# EAGLE design SVS (EAGLE 8.7.1)
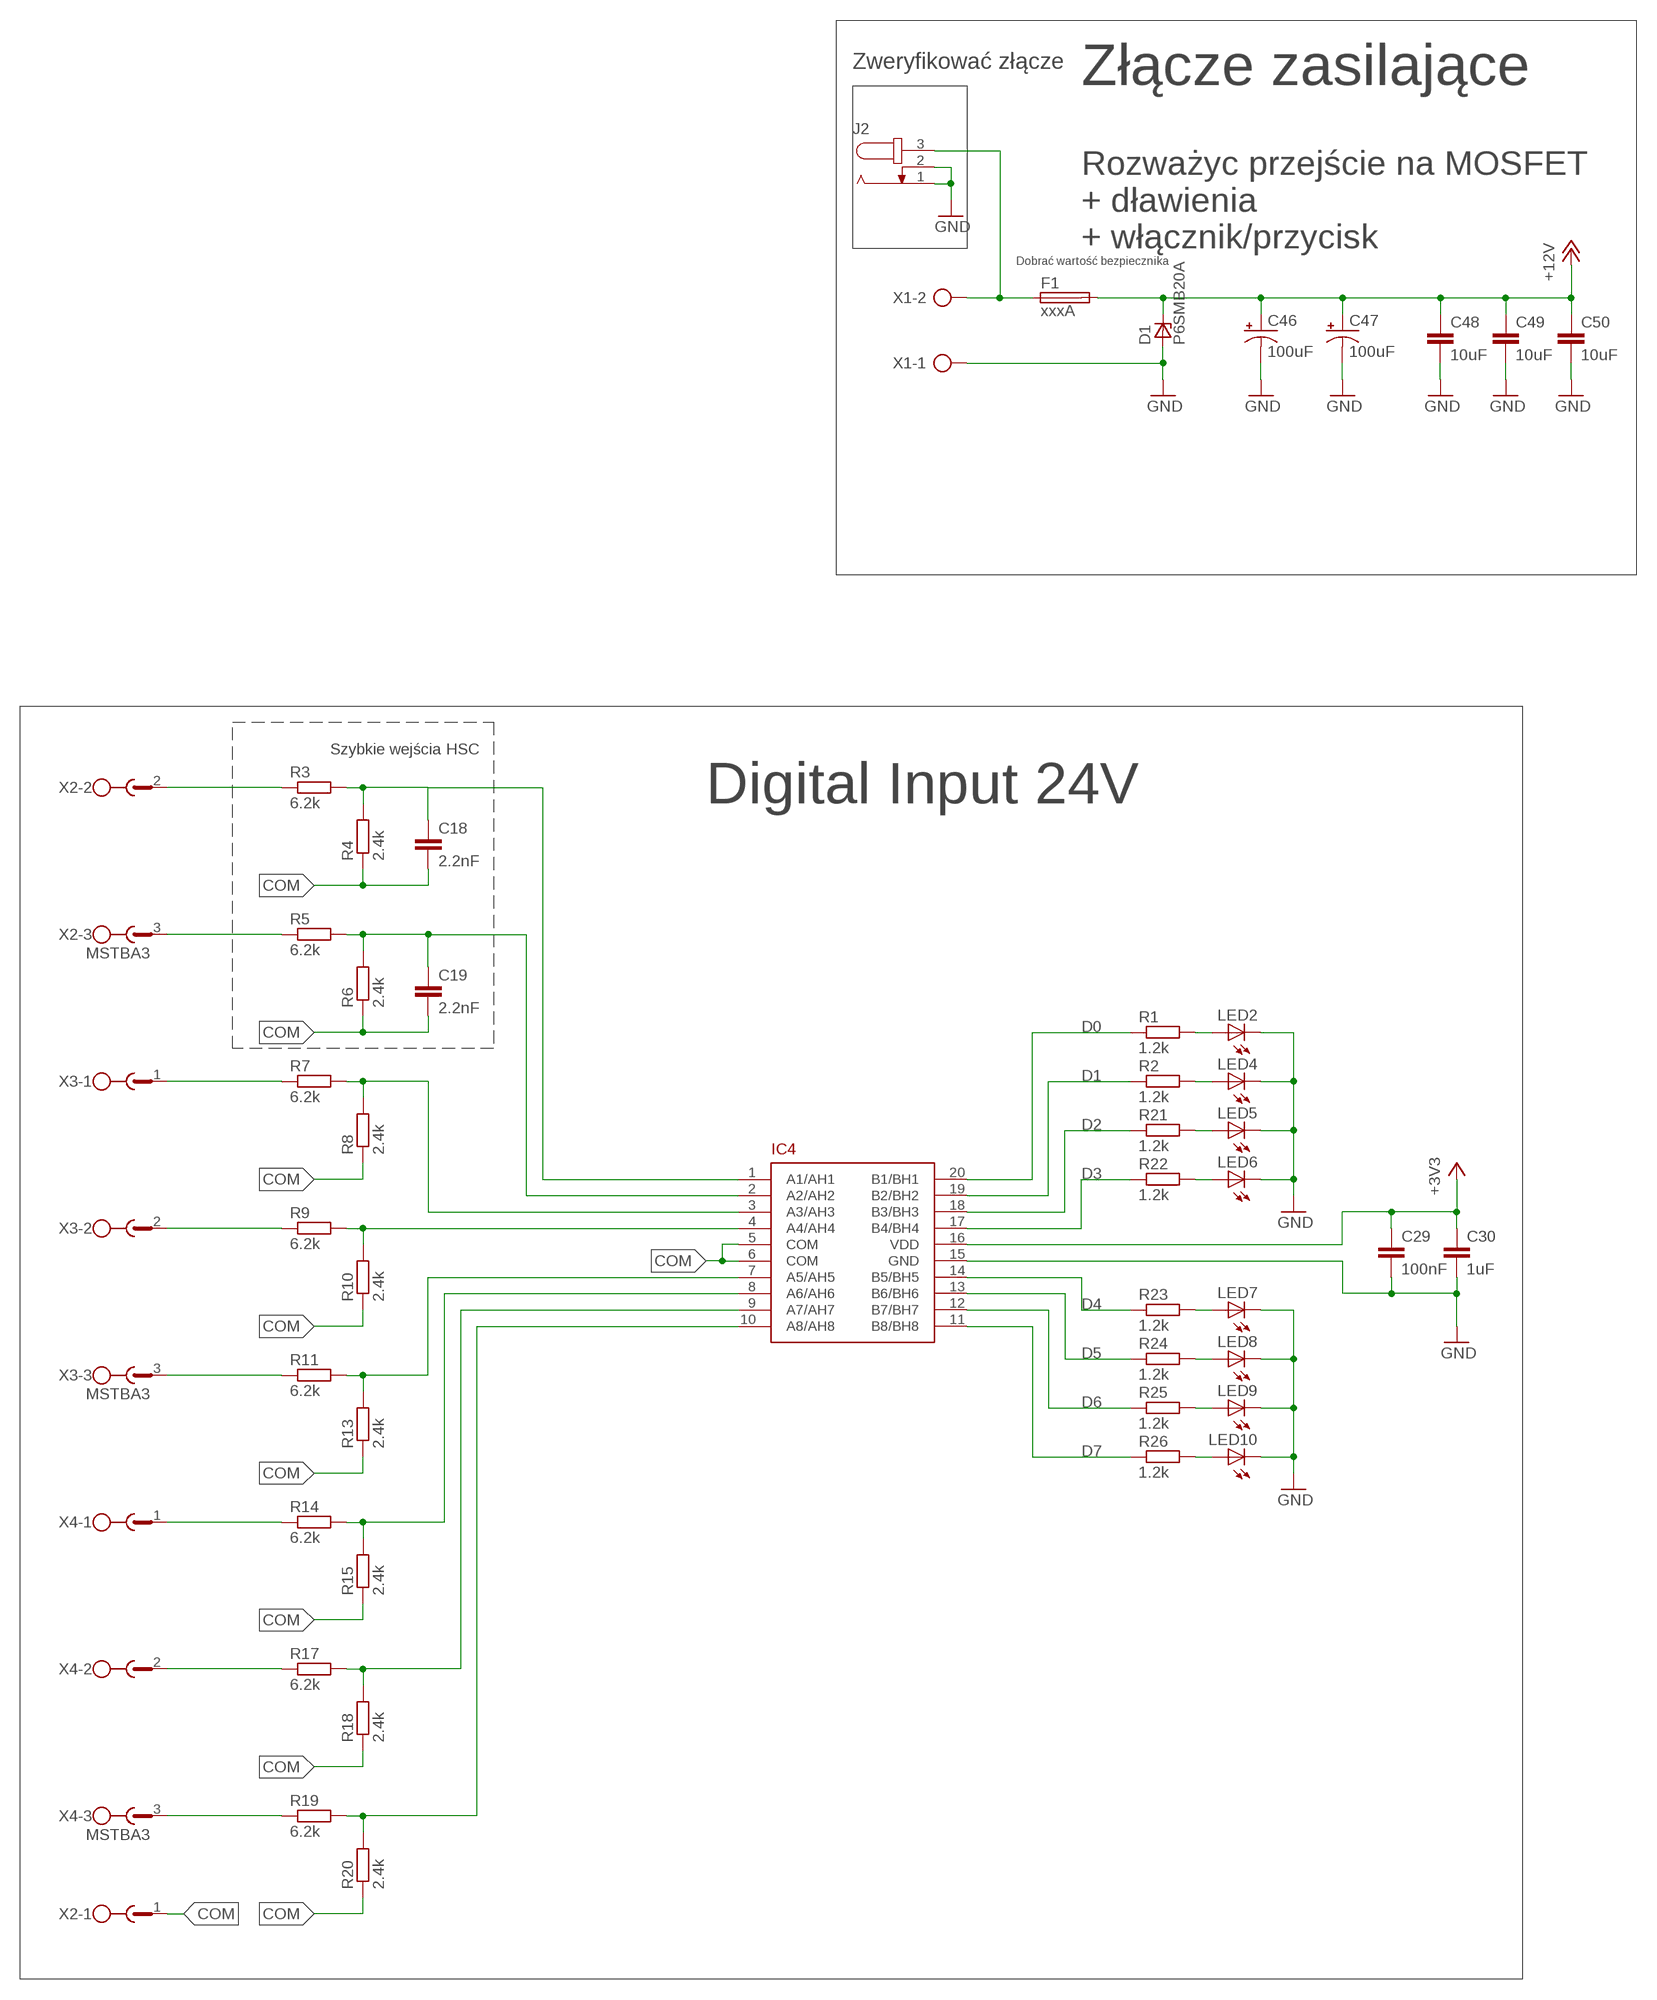
[diagram p0: schematic, sheet 1, part 1 of 3]
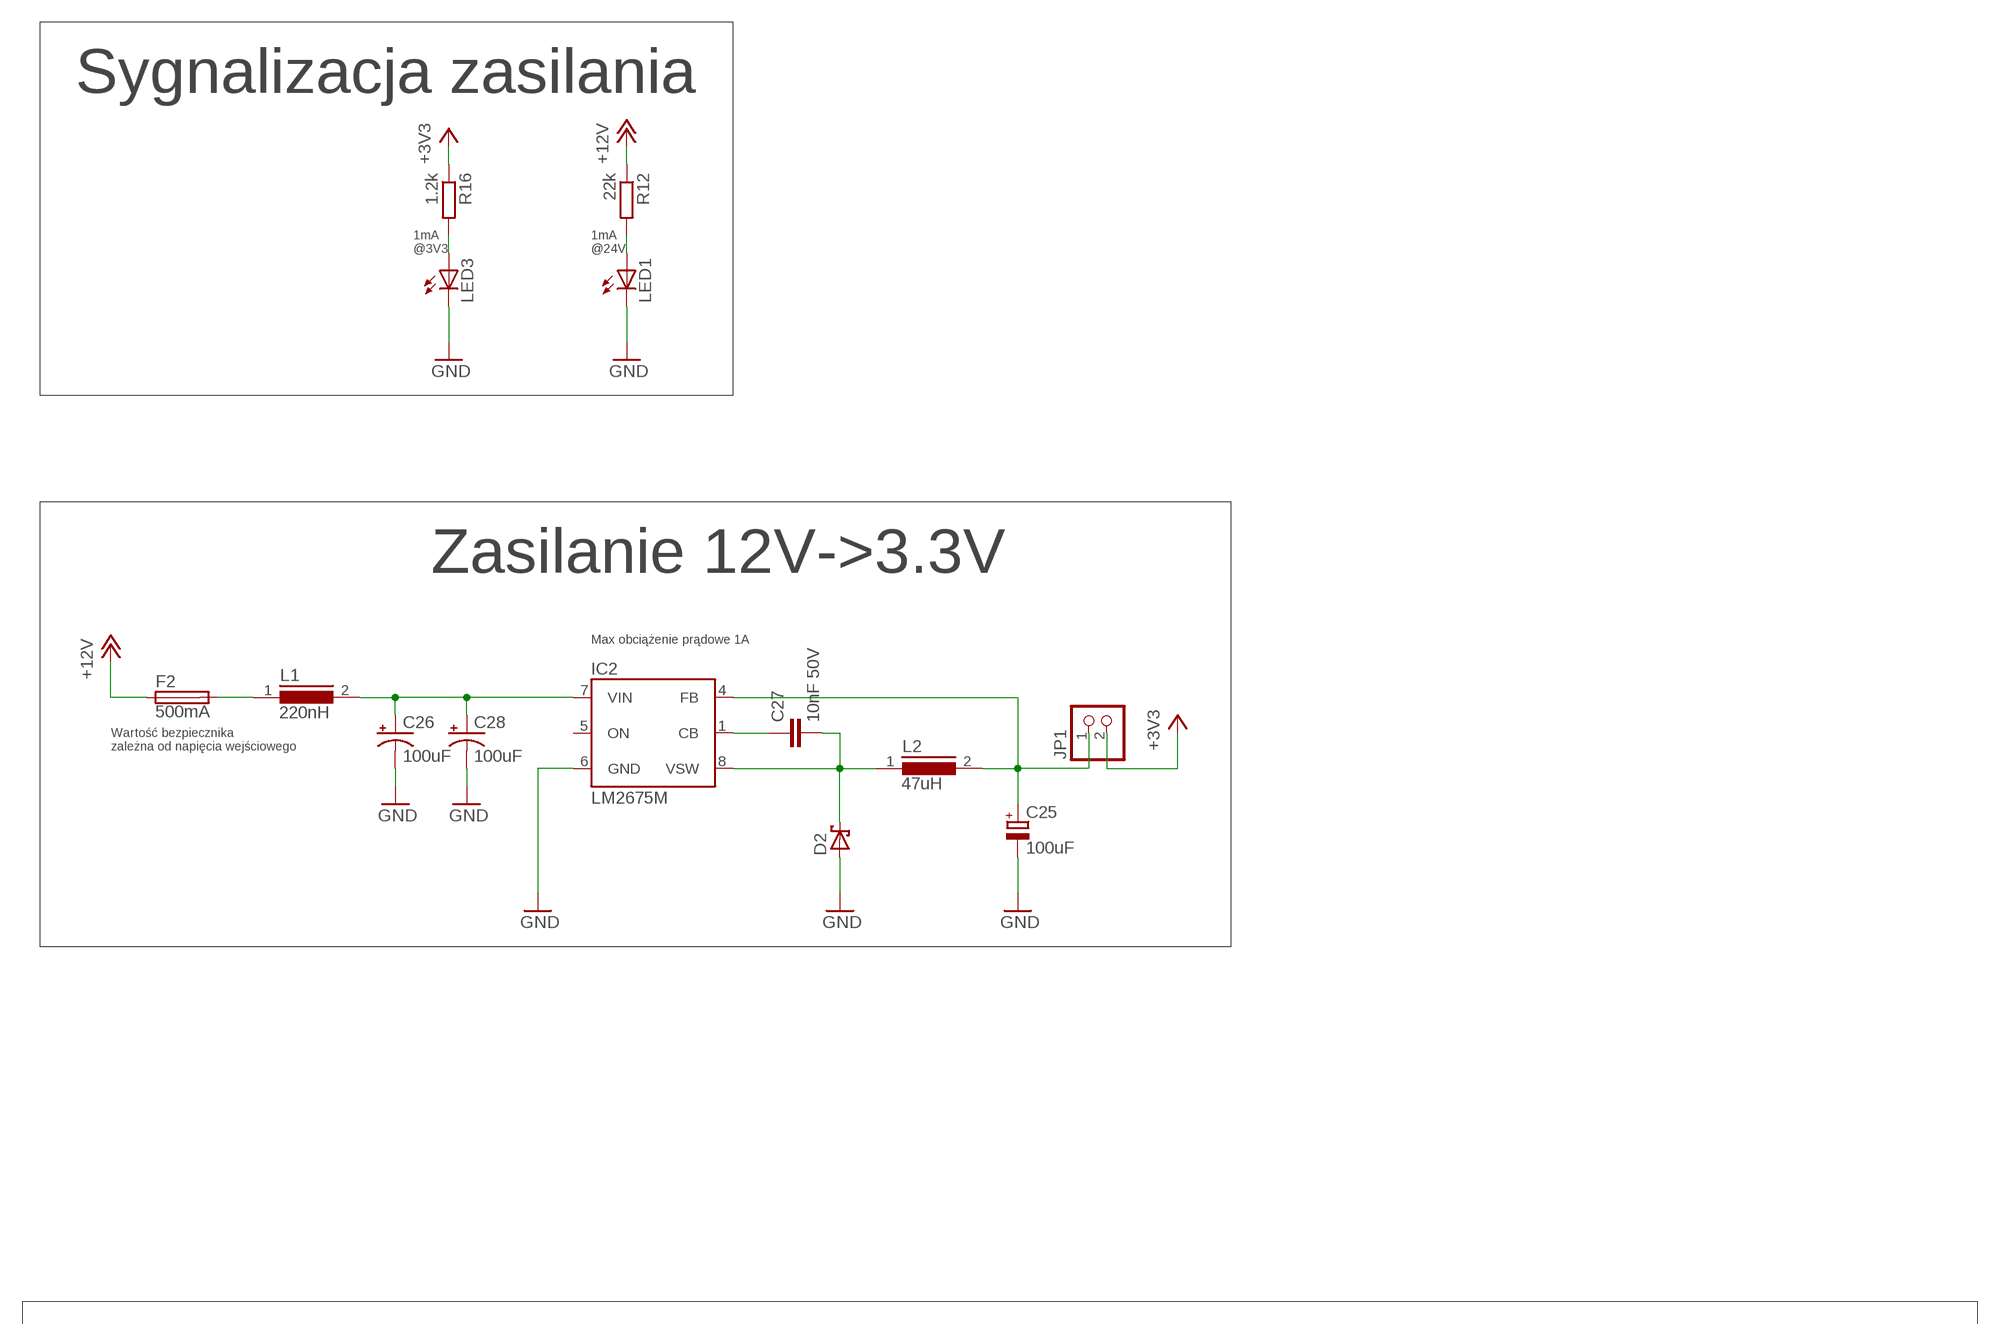
[diagram p1: schematic, sheet 1, part 2 of 3]
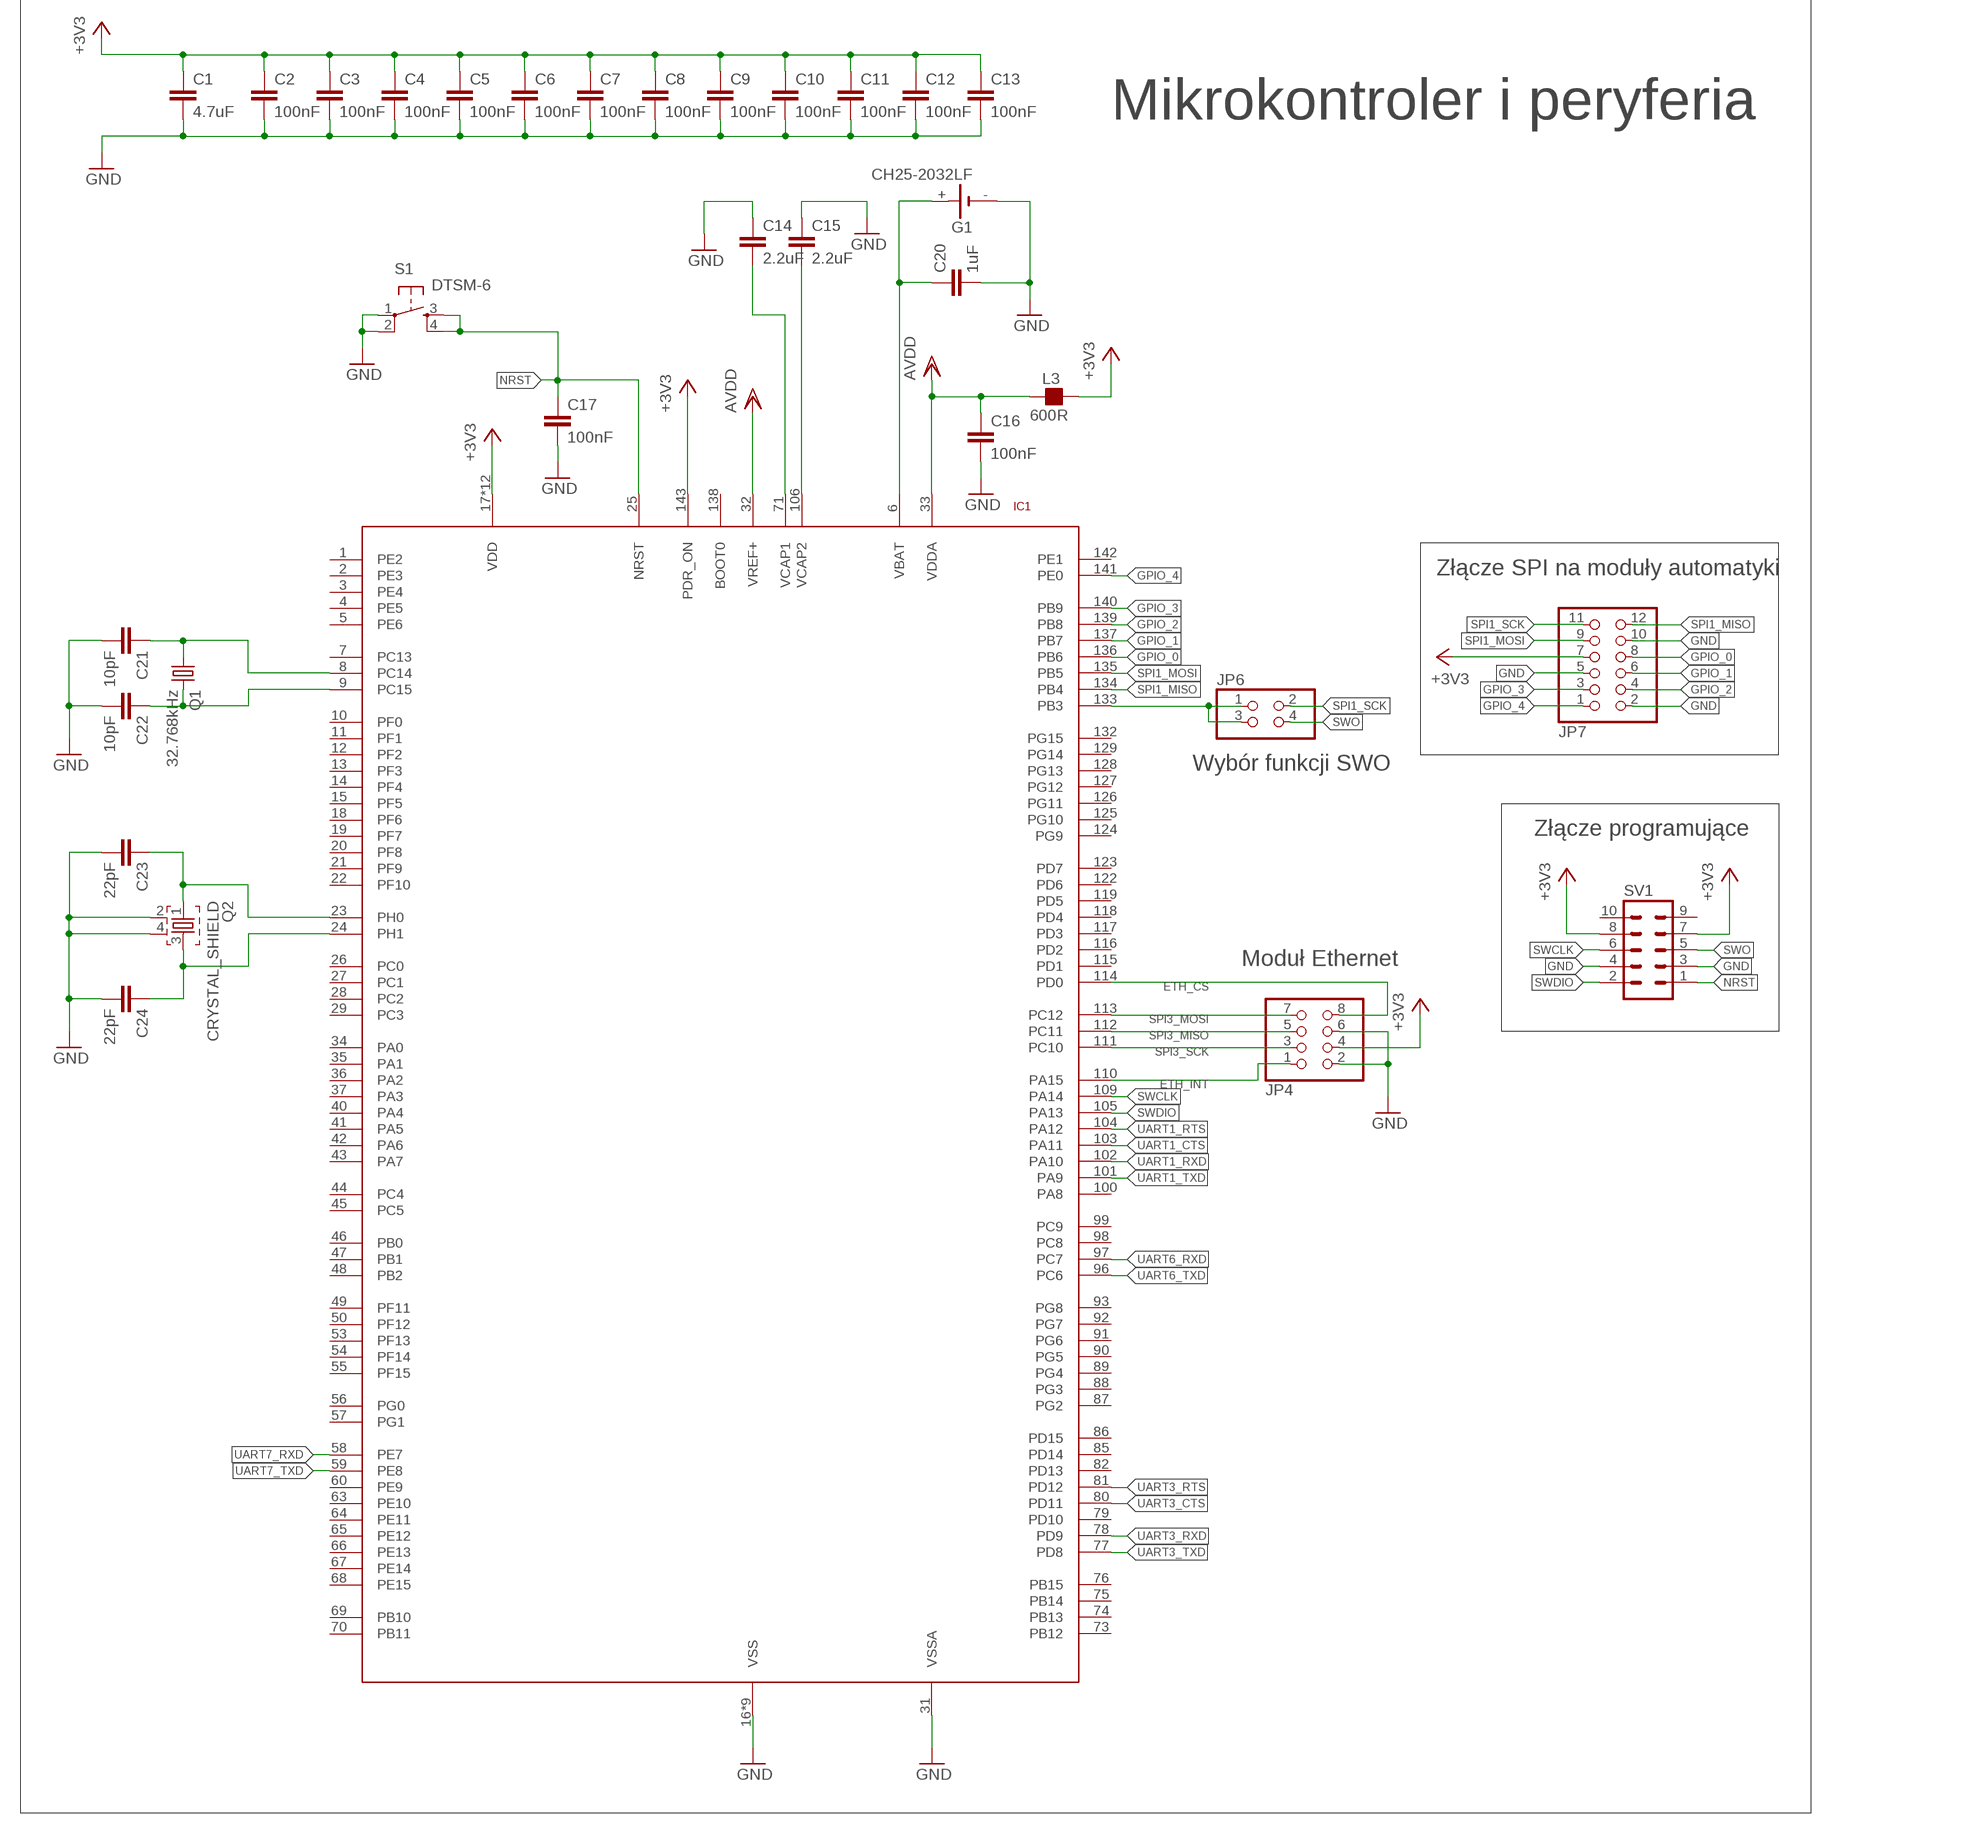
[diagram p2: schematic, sheet 1, part 3 of 3]

## Parts
C1  4.7uF  C-EUC0603K  [C0603K]
C2  100nF  C-EUC0603K  [C0603K]
C3  100nF  C-EUC0603K  [C0603K]
C4  100nF  C-EUC0603K  [C0603K]
C5  100nF  C-EUC0603K  [C0603K]
C6  100nF  C-EUC0603K  [C0603K]
C7  100nF  C-EUC0603K  [C0603K]
C8  100nF  C-EUC0603K  [C0603K]
C9  100nF  C-EUC0603K  [C0603K]
C10  100nF  C-EUC0603K  [C0603K]
C11  100nF  C-EUC0603K  [C0603K]
C12  100nF  C-EUC0603K  [C0603K]
C13  100nF  C-EUC0603K  [C0603K]
C14  2.2uF  C-EUC0603K  [C0603K]
C15  2.2uF  C-EUC0603K  [C0603K]
C16  100nF  C-EUC0603K  [C0603K]
C17  100nF  C-EUC0603K  [C0603K]
C18  2.2nF  C-EUC0805  [C0805]
C19  2.2nF  C-EUC0805  [C0805]
C20  1uF  C-EUC0603K  [C0603K]
C21  10pF  C-EUC0603K  [C0603K]
C22  10pF  C-EUC0603K  [C0603K]
C23  22pF  C-EUC0603K  [C0603K]
C24  22pF  C-EUC0603K  [C0603K]
C25  100uF  CPOL-EUSMCC  [SMC_C]
C26  100uF  CPOL-USUD-8X10  [UD-8X10_NICHICON]
C27  10nF 50V  C-EUC0603  [C0603]
C28  100uF  CPOL-USUD-8X10  [UD-8X10_NICHICON]
C29  100nF  C-EUC0603K  [C0603K]
C30  1uF  C-EUC0603K  [C0603K]
C46  100uF  CPOL-USUD-8X10  [UD-8X10_NICHICON]
C47  100uF  CPOL-USUD-8X10  [UD-8X10_NICHICON]
C48  10uF  C-EUC0805  [C0805]
C49  10uF  C-EUC0805  [C0805]
C50  10uF  C-EUC0805  [C0805]
D1  P6SMB20A  [SMB_A]
D2  SCHOTTKY-DIODESMD  [SMB]
F1  xxxA  TR5  [TR5]
F2  500mA  TR5  [TR5]
G1  CH25-2032LF  [CH25-2032LF]
IC1  STM32F429ZILQFP144  [LQFP144]
IC2  LM2675M  [SO08]
IC4  SI838X  [QSOP-20]
J2  JACK-PLUG1  [SPC4078]
JP1  PINHD-1X2  [1X02]
JP4  PINHD-2X4  [2X04]
JP6  PINHD-2X2  [2X02]
JP7  PINHD-2X6/90  [2X06/90]
L1  220nH  SRP7028A-R33M  [7.3X6.3]
L2  47uH  SRR1280-101M  [12.5X12.5]
L3  600R  FB_0603  [L0603]
LED1  LEDCHIP-LED0603  [CHIP-LED0603]
LED2  LEDCHIP-LED0603  [CHIP-LED0603]
LED3  LEDCHIP-LED0603  [CHIP-LED0603]
LED4  LEDCHIP-LED0603  [CHIP-LED0603]
LED5  LEDCHIP-LED0603  [CHIP-LED0603]
LED6  LEDCHIP-LED0603  [CHIP-LED0603]
LED7  LEDCHIP-LED0603  [CHIP-LED0603]
LED8  LEDCHIP-LED0603  [CHIP-LED0603]
LED9  LEDCHIP-LED0603  [CHIP-LED0603]
LED10  LEDCHIP-LED0603  [CHIP-LED0603]
Q1  32.768kHz  CRYSTAL3.5X1.5  [CRYSTAL_3.5X1.5]
Q2  CRYSTAL_SHIELD  [CRYSTAL_5X3.2]
R1  1.2k  R-EU_R0603  [R0603]
R2  1.2k  R-EU_R0603  [R0603]
R3  6.2k  R-EU_R1206  [R1206]
R4  2.4k  R-EU_R1206  [R1206]
R5  6.2k  R-EU_R1206  [R1206]
R6  2.4k  R-EU_R1206  [R1206]
R7  6.2k  R-EU_R1206  [R1206]
R8  2.4k  R-EU_R1206  [R1206]
R9  6.2k  R-EU_R1206  [R1206]
R10  2.4k  R-EU_R1206  [R1206]
R11  6.2k  R-EU_R1206  [R1206]
R12  22k  R-EU_R0603  [R0603]
R13  2.4k  R-EU_R1206  [R1206]
R14  6.2k  R-EU_R1206  [R1206]
R15  2.4k  R-EU_R1206  [R1206]
R16  1.2k  R-EU_R0603  [R0603]
R17  6.2k  R-EU_R1206  [R1206]
R18  2.4k  R-EU_R1206  [R1206]
R19  6.2k  R-EU_R1206  [R1206]
R20  2.4k  R-EU_R1206  [R1206]
R21  1.2k  R-EU_R0603  [R0603]
R22  1.2k  R-EU_R0603  [R0603]
R23  1.2k  R-EU_R0603  [R0603]
R24  1.2k  R-EU_R0603  [R0603]
R25  1.2k  R-EU_R0603  [R0603]
R26  1.2k  R-EU_R0603  [R0603]
S1  DTSM-6  [DTSM-6]
SV1  ML10  [ML10]
X1  AK300/2  [AK300/2]
X2  MSTBA3  [MSTBA3]
X3  MSTBA3  [MSTBA3]
X4  MSTBA3  [MSTBA3]

## Nets
+3V3: C1.1 C2.1 C3.1 C4.1 C5.1 C6.1 C7.1 C8.1 C9.1 C10.1 C11.1 C12.1 C13.1 C29.1 C30.1 IC1.17(VDD) IC1.30(VDD) IC1.39(VDD) IC1.52(VDD) IC1.62(VDD) IC1.72(VDD) IC1.84(VDD) IC1.95(VDD) IC1.108(VDD) IC1.121(VDD) IC1.131(VDD) IC1.143(PDR_ON) IC1.144(VDD) IC4.16(VDD) JP1.2 JP4.4 JP7.7 L3.2 R16.1 SV1.7 SV1.8
+12V: C46.+ C47.+ C48.1 C49.1 C50.1 D1.C F1.2 F2.1 R12.1
AVDD: IC1.32(VREF+)
COM: C18.2 C19.2 IC4.5(COM) IC4.6(COM) R4.1 R6.1 R8.1 R10.1 R13.1 R15.1 R18.1 R20.1 X2.1
D0: IC4.20(B1/BH1) R1.1
D1: IC4.19(B2/BH2) R2.1
D2: IC4.18(B3/BH3) R21.1
D3: IC4.17(B4/BH4) R22.1
D4: IC4.14(B5/BH5) R23.1
D5: IC4.13(B6/BH6) R24.1
D6: IC4.12(B7/BH7) R25.1
D7: IC4.11(B8/BH8) R26.1
ETH_CS: IC1.114(PD0) JP4.8
ETH_INT: IC1.110(PA15) JP4.1
GND: C1.2 C2.2 C3.2 C4.2 C5.2 C6.2 C7.2 C8.2 C9.2 C10.2 C11.2 C12.2 C13.2 C14.1 C15.1 C16.2 C17.2 C20.2 C21.2 C22.2 C23.2 C24.2 C25.- C26.- C28.- C29.2 C30.2 C46.- C47.- C48.2 C49.2 C50.2 D1.A D2.A G1.- IC1.16(VSS) IC1.31(VSSA) IC1.38(VSS) IC1.51(VSS) IC1.61(VSS) IC1.83(VSS) IC1.94(VSS) IC1.107(VSS) IC1.120(VSS) IC1.130(VSS) IC2.6(GND) IC4.15(GND) J2.1 J2.2 JP4.2 JP4.6 JP7.2 JP7.5 JP7.10 LED1.C LED2.C LED3.C LED4.C LED5.C LED6.C LED7.C LED8.C LED9.C LED10.C Q2.2 Q2.4 S1.1 S1.2 SV1.3 SV1.4 X1.1
GPIO_0: IC1.136(PB6) JP7.8
GPIO_1: IC1.137(PB7) JP7.6
GPIO_2: IC1.139(PB8) JP7.4
GPIO_3: IC1.140(PB9) JP7.3
GPIO_4: IC1.141(PE0) JP7.1
N$1: F1.1 J2.3 X1.2
N$2: C14.2 IC1.71(VCAP1)
N$3: C15.2 IC1.106(VCAP2)
N$4: C21.1 IC1.8(PC14) Q1.1
N$5: C22.1 IC1.9(PC15) Q1.2
N$6: IC1.133(PB3) JP6.1 JP6.3
N$7: C23.1 IC1.23(PH0) Q2.1
N$8: C24.1 IC1.24(PH1) Q2.3
N$9: C18.1 IC4.1(A1/AH1) R3.2 R4.2
N$10: F2.2 L1.1
N$11: LED2.A R1.2
N$12: C19.1 IC4.2(A2/AH2) R5.2 R6.2
N$13: LED4.A R2.2
N$14: LED5.A R21.2
N$15: R3.1 X2.2
N$16: C27.1 IC2.1(CB)
N$17: LED6.A R22.2
N$18: R5.1 X2.3
N$19: IC4.3(A3/AH3) R7.2 R8.2
N$20: R7.1 X3.1
N$21: IC4.4(A4/AH4) R9.2 R10.2
N$22: R9.1 X3.2
N$23: IC4.7(A5/AH5) R11.2 R13.2
N$24: R11.1 X3.3
N$25: IC4.8(A6/AH6) R14.2 R15.2
N$26: R14.1 X4.1
N$27: IC4.9(A7/AH7) R17.2 R18.2
N$28: R17.1 X4.2
N$29: IC4.10(A8/AH8) R19.2 R20.2
N$30: R19.1 X4.3
N$31: LED1.A R12.2
N$32: LED7.A R23.2
N$33: LED8.A R24.2
N$34: LED9.A R25.2
N$35: LED10.A R26.2
N$37: C25.+ IC2.4(FB) JP1.1 L2.2
N$42: LED3.A R16.2
NRST: C17.1 IC1.25(NRST) S1.3 S1.4 SV1.1
SPI1_MISO: IC1.134(PB4) JP7.12
SPI1_MOSI: IC1.135(PB5) JP7.9
SPI1_SCK: JP6.2 JP7.11
SPI3_MISO: IC1.112(PC11) JP4.5
SPI3_MOSI: IC1.113(PC12) JP4.7
SPI3_SCK: IC1.111(PC10) JP4.3
SWCLK: IC1.109(PA14) SV1.6
SWDIO: IC1.105(PA13) SV1.2
SWO: JP6.4 SV1.5
UART1_CTS: IC1.103(PA11)
UART1_RTS: IC1.104(PA12)
UART1_RXD: IC1.102(PA10)
UART1_TXD: IC1.101(PA9)
UART3_CTS: IC1.80(PD11)
UART3_RTS: IC1.81(PD12)
UART3_RXD: IC1.78(PD9)
UART3_TXD: IC1.77(PD8)
UART6_RXD: IC1.97(PC7)
UART6_TXD: IC1.96(PC6)
UART7_RXD: IC1.58(PE7)
UART7_TXD: IC1.59(PE8)
VBAT: C20.1 G1.+ IC1.6(VBAT)
VDD: C16.1 IC1.33(VDDA) L3.1 ; supply symbol labelled AVDD
VIN: C26.+ C28.+ IC2.7(VIN) L1.2
VSW: C27.2 D2.C IC2.8(VSW) L2.1
Unconnected: IC1.1(PE2) IC1.2(PE3) IC1.3(PE4) IC1.4(PE5) IC1.5(PE6) IC1.7(PC13) IC1.10(PF0) IC1.11(PF1) IC1.12(PF2) IC1.13(PF3) IC1.14(PF4) IC1.15(PF5) IC1.18(PF6) IC1.19(PF7) IC1.20(PF8) IC1.21(PF9) IC1.22(PF10) IC1.26(PC0) IC1.27(PC1) IC1.28(PC2) IC1.29(PC3) IC1.34(PA0) IC1.35(PA1) IC1.36(PA2) IC1.37(PA3) IC1.40(PA4) IC1.41(PA5) IC1.42(PA6) IC1.43(PA7) IC1.44(PC4) IC1.45(PC5) IC1.46(PB0) IC1.47(PB1) IC1.48(PB2) IC1.49(PF11) IC1.50(PF12) IC1.53(PF13) IC1.54(PF14) IC1.55(PF15) IC1.56(PG0) IC1.57(PG1) IC1.60(PE9) IC1.63(PE10) IC1.64(PE11) IC1.65(PE12) IC1.66(PE13) IC1.67(PE14) IC1.68(PE15) IC1.69(PB10) IC1.70(PB11) IC1.73(PB12) IC1.74(PB13) IC1.75(PB14) IC1.76(PB15) IC1.79(PD10) IC1.82(PD13) IC1.85(PD14) IC1.86(PD15) IC1.87(PG2) IC1.88(PG3) IC1.89(PG4) IC1.90(PG5) IC1.91(PG6) IC1.92(PG7) IC1.93(PG8) IC1.98(PC8) IC1.99(PC9) IC1.100(PA8) IC1.115(PD1) IC1.116(PD2) IC1.117(PD3) IC1.118(PD4) IC1.119(PD5) IC1.122(PD6) IC1.123(PD7) IC1.124(PG9) IC1.125(PG10) IC1.126(PG11) IC1.127(PG12) IC1.128(PG13) IC1.129(PG14) IC1.132(PG15) IC1.138(BOOT0) IC1.142(PE1) IC2.5(ON) SV1.9 SV1.10

## Notes on the sheet
- Zweryfikować złącze
- Złącze zasilające | Sygnalizacja zasilania
- 1mA
  @3V3
- 1mA
  @24V
- Rozważyc przejście na MOSFET
  + dławienia
  + włącznik/przycisk
- Dobrać wartość bezpiecznika
- Zasilanie 12V->3.3V
- Max obciążenie prądowe 1A
- Wartość bezpiecznika 
  zależna od napięcia wejściowego
- Szybkie wejścia HSC
- Digital Input 24V
- Mikrokontroler i peryferia
- Złącze SPI na moduły automatyki
- Wybór funkcji SWO
- Złącze programujące
- Moduł Ethernet

## Library data of the parts
C1 = rcl:C-EU: CAPACITOR, European symbol; MF: AVX; MPN: 0603ZD475KAT2A; SPICEPREFIX: C
C2-C13 C16 C17 C29 = rcl:C-EU: CAPACITOR, European symbol; MF: AVX; MPN: 06033C104KAT2A; SPICEPREFIX: C
C14 C15 = rcl:C-EU: CAPACITOR, European symbol; MF: AVX; MPN: 06036C225KAT2A; SPICEPREFIX: C
C18 C19 = rcl:C-EU: CAPACITOR, European symbol; MF: AVX; MPN: 06035C222JAT2A; SPICEPREFIX: C
C20 C30 = rcl:C-EU: CAPACITOR, European symbol; MF: AVX; MPN: 0603YC105KAT4A; SPICEPREFIX: C
C21 C22 = rcl:C-EU: CAPACITOR, European symbol; MF: AVX; MPN: 06035A100JAT2A; SPICEPREFIX: C
C23 C24 = rcl:C-EU: CAPACITOR, European symbol; MF: AVX; MPN: 06035A220JAT2A; SPICEPREFIX: C
C25 = rcl:CPOL-EU: POLARIZED CAPACITOR, European symbol; MF: AVX; MPN: TAJC107K010TNJ; SPICEPREFIX: C
C26 C28 C46 C47 = rcl:CPOL-US: POLARIZED CAPACITOR, American symbol; MF: Nichicon; MPN: UCD1H101MNL1GS; SPICEPREFIX: C
C27 = rcl:C-EU: CAPACITOR, European symbol; MF: AVX; MPN: 06035C103KAT2A; SPICEPREFIX: C
C48-C50 = rcl:C-EU: CAPACITOR, European symbol; MF: Murata Electronics; MPN: GRM21BR6YA106KE43L; SPICEPREFIX: C
D1 = suppressor_SMAJ_SM6T_P6SMB:P6SMB*A: P6SMBxxA Series of unidirectional Transient Voltage Suppressor Diodes xx = Stand-off Voltage VR in Volts; PPmax = 600 W Case: SMB = DO 214 AA Note: Footprint acc. to ST specs; source: www.st.com Author: Dipl.-Ing. FH Rainer Bayer, www.ing-rb.de/hhn Feedback: rainer.bayer@hs-heilbronn.de; MF: Littelfuse; MPN: TPSMB24A-VR
D2 = diode:SCHOTTKY-DIODE: Schottky Diode; MF: ON Semiconductor; MPN: SS26T3G
F1 F2 = fuse:TR5: FUSE Wickmann; OC_FARNELL: unknown; OC_NEWARK: unknown
G1 = wlasne:CH25-2032LF: Podstawka - bateria pastylka Producent COMF Typ akcesoriów do baterii podstawka Rozmiar ogniwa 2032, BR2032, CR2032 Ilość baterii 1; MF: G1; MPN: CH25-2032
IC1 = SVS:STM32F429ZI; MF: STMicroelectronics; MPN: STM32F429ZIT6
IC2 = v-reg-3:LM2675: National Semiconductor <http://www.national.com> 1.0A "Simple Switcher"(c) 260kHz, Vout 1.2-37V, Vin 40V, 250mOhm DMOS switch, 50µA standby current; MF: Texas Instruments; MPN: LM2675MX-3.3/NOPB
IC4 = wlasne:SI838X; MF: Silicon Labs; MPN: SI8382P-IU
J2 = con-jack:JACK-PLUG: DC POWER JACK Power Jack, DC, Right Angle, Through Hole, Rated 5A at 16VDC, PC Terminals Distributor: Farnell (www.Farnell.de) Drawing: 84N1161.pdf / 84N1162.pdf Manufacturer: SPC Technology (www.spctechnology.com) Type: SPC4077 / SPC 4078; OC_FARNELL: unknown; OC_NEWARK: unknown
JP1 = pinhead:PINHD-1X2: PIN HEADER
JP4 = pinhead:PINHD-2X4: PIN HEADER
JP6 = pinhead:PINHD-2X2: PIN HEADER
JP7 = pinhead:PINHD-2X6: PIN HEADER
L1 = wlasne:SRP7028A-R33M: SRP7028A-R33M Manufacturer: Bourns Product Category: Fixed Inductors RoHS: Details Series: SRP7028A Inductance: 330 nH Tolerance: 20 % Maximum DC Current: 32 A Maximum DC Resistance: 3.9 mOhms Minimum Operating Temperature: - 40 C Maximum Operating Temperature: + 150 C Q Minimum: 10 Test Frequency: 100 kHz Product: Power Inductors Shielding: Shielded Termination Style: SMD/SMT Termination: - Mounting Style: SMD/SMT Length: 7.3 mm Width: 6.6 mm Height: 2.8 mm Qualification: AEC-Q200 Packaging: Cut Tape Packaging: MouseReel Packaging: Reel Type: AEC-Q200 Shielded Power Inductor Core Material: Carbonyl Iron Powder Self Resonant Frequency: 140 MHz Brand: Bourns Factory Pack Quantity: 1000 Unit Weight: 1 g; MF: Bourns; MPN: SRP7028A-R22Y
L2 = wlasne:SRR1280-101M: SRR1280-101M Manufacturer: Bourns Product Category: Fixed Inductors RoHS: Details Series: SRR1280 Inductance: 100 uH Tolerance: 20 % Maximum DC Current: 2.1 A Maximum DC Resistance: 150 mOhms Minimum Operating Temperature: - 40 C Maximum Operating Temperature: + 125 C Q Minimum: 18 Product: Power Inductors Shielding: Shielded Termination Style: SMD/SMT Termination: - Mounting Style: SMD/SMT Package/Case: 5050 Length: 12.5 mm Width: 12.5 mm Height: 7.5 mm Packaging: Cut Tape Packaging: MouseReel Packaging: Reel Type: Shielded Power Inductor Self Resonant Frequency: 4.5 MHz Brand: Bourns Factory Pack Quantity: 400 Unit Weight: 4,200 g; MF: Bourns; MPN: SRR1280-470M
L3 = rc-master-smd:FB_: FERRITE BEAD; MF: TDK; MPN: MMZ1608S601ATD25
LED1 LED3 = led:LED: LED OSRAM: - CHIPLED LG R971, LG N971, LY N971, LG Q971, LY Q971, LO R971, LY R971 LH N974, LH R974 LS Q976, LO Q976, LY Q976 LO Q996 - Hyper CHIPLED LW Q18S LB Q993, LB Q99A, LB R99A - SideLED LS A670, LO A670, LY A670, LG A670, LP A670 LB A673, LV A673, LT A673, LW A673 LH A674 LY A675 LS A676, LA A676, LO A676, LY A676, LW A676 LS A679, LY A679, LG A679 - Hyper Micro SIDELED® LS Y876, LA Y876, LO Y876, LY Y876 LT Y87S - SmartLED LW L88C, LW L88S LB L89C, LB L89S, LG L890 LS L89K, LO L89K, LY L89K LS L896, LA L896, LO L896, LY L896 - TOPLED LS T670, LO T670, LY T670, LG T670, LP T670 LSG T670, LSP T670, LSY T670, LOP T670, LYG T670 LG T671, LOG T671, LSG T671 LB T673, LV T673, LT T673, LW T673 LH T674 LS T676, LA T676, LO T676, LY T676, LB T676, LH T676, LSB T676, LW T676 LB T67C, LV T67C, LT T67C, LS T67K, LO T67K, LY T67K, LW E67C LS E67B, LA E67B, LO E67B, LY E67B, LB E67C, LV E67C, LT E67C LW T67C LS T679, LY T679, LG T679 LS T770, LO T770, LY T770, LG T770, LP T770 LB T773, LV T773, LT T773, LW T773 LH T774 LS E675, LA E675, LY E675, LS T675 LS T776, LA T776, LO T776, LY T776, LB T776 LHGB T686 LT T68C, LB T68C - Hyper Mini TOPLED® LB M676 - Mini TOPLED Santana® LG M470 LS M47K, LO M47K, LY M47K Source: http://www.osram.convergy.de LUXEON: - LUMILED® LXK2-PW12-R00, LXK2-PW12-S00, LXK2-PW14-U00, LXK2-PW14-V00 LXK2-PM12-R00, LXK2-PM12-S00, LXK2-PM14-U00 LXK2-PE12-Q00, LXK2-PE12-R00, LXK2-PE12-S00, LXK2-PE14-T00, LXK2-PE14-U00 LXK2-PB12-K00, LXK2-PB12-L00, LXK2-PB12-M00, LXK2-PB14-N00, LXK2-PB14-P00, LXK2-PB14-Q00 LXK2-PR12-L00, LXK2-PR12-M00, LXK2-PR14-Q00, LXK2-PR14-R00 LXK2-PD12-Q00, LXK2-PD12-R00, LXK2-PD12-S00 LXK2-PH12-R00, LXK2-PH12-S00 LXK2-PL12-P00, LXK2-PL12-Q00, LXK2-PL12-R00 Source: www.luxeon.com KINGBRIGHT: KA-3528ASYC Source: www.kingbright.com; MF: Kingbright; MPN: APTD1608LSURCK
LED2 LED4-LED10 = led:LED: LED OSRAM: - CHIPLED LG R971, LG N971, LY N971, LG Q971, LY Q971, LO R971, LY R971 LH N974, LH R974 LS Q976, LO Q976, LY Q976 LO Q996 - Hyper CHIPLED LW Q18S LB Q993, LB Q99A, LB R99A - SideLED LS A670, LO A670, LY A670, LG A670, LP A670 LB A673, LV A673, LT A673, LW A673 LH A674 LY A675 LS A676, LA A676, LO A676, LY A676, LW A676 LS A679, LY A679, LG A679 - Hyper Micro SIDELED® LS Y876, LA Y876, LO Y876, LY Y876 LT Y87S - SmartLED LW L88C, LW L88S LB L89C, LB L89S, LG L890 LS L89K, LO L89K, LY L89K LS L896, LA L896, LO L896, LY L896 - TOPLED LS T670, LO T670, LY T670, LG T670, LP T670 LSG T670, LSP T670, LSY T670, LOP T670, LYG T670 LG T671, LOG T671, LSG T671 LB T673, LV T673, LT T673, LW T673 LH T674 LS T676, LA T676, LO T676, LY T676, LB T676, LH T676, LSB T676, LW T676 LB T67C, LV T67C, LT T67C, LS T67K, LO T67K, LY T67K, LW E67C LS E67B, LA E67B, LO E67B, LY E67B, LB E67C, LV E67C, LT E67C LW T67C LS T679, LY T679, LG T679 LS T770, LO T770, LY T770, LG T770, LP T770 LB T773, LV T773, LT T773, LW T773 LH T774 LS E675, LA E675, LY E675, LS T675 LS T776, LA T776, LO T776, LY T776, LB T776 LHGB T686 LT T68C, LB T68C - Hyper Mini TOPLED® LB M676 - Mini TOPLED Santana® LG M470 LS M47K, LO M47K, LY M47K Source: http://www.osram.convergy.de LUXEON: - LUMILED® LXK2-PW12-R00, LXK2-PW12-S00, LXK2-PW14-U00, LXK2-PW14-V00 LXK2-PM12-R00, LXK2-PM12-S00, LXK2-PM14-U00 LXK2-PE12-Q00, LXK2-PE12-R00, LXK2-PE12-S00, LXK2-PE14-T00, LXK2-PE14-U00 LXK2-PB12-K00, LXK2-PB12-L00, LXK2-PB12-M00, LXK2-PB14-N00, LXK2-PB14-P00, LXK2-PB14-Q00 LXK2-PR12-L00, LXK2-PR12-M00, LXK2-PR14-Q00, LXK2-PR14-R00 LXK2-PD12-Q00, LXK2-PD12-R00, LXK2-PD12-S00 LXK2-PH12-R00, LXK2-PH12-S00 LXK2-PL12-P00, LXK2-PL12-Q00, LXK2-PL12-R00 Source: www.luxeon.com KINGBRIGHT: KA-3528ASYC Source: www.kingbright.com; MF: Kingbright; MPN: APTD1608LCGCK
Q1 = SVS:CRYSTAL: CRYSTAL; MF: ECS; MPN: ECS-.327-9-34QCS-TR
Q2 = SVS:CRYSTAL_SHIELD; MF: IQD; MPN: LFXTAL059158
R1 R2 R16 R21-R26 = rcl:R-EU_: RESISTOR, European symbol; MF: Yageo; MPN: RC0603FR-071K2L; SPICEPREFIX: R
R3 R5 R7 R9 R11 R14 R17 R19 = rcl:R-EU_: RESISTOR, European symbol; MF: Yageo; MPN: RC1206JR-076K2L; SPICEPREFIX: R
R4 R6 R8 R10 R13 R15 R18 R20 = rcl:R-EU_: RESISTOR, European symbol; MF: Yageo; MPN: RC1206JR-072K4L; SPICEPREFIX: R
R12 = rcl:R-EU_: RESISTOR, European symbol; MF: Yageo; MPN: RC0603FR-0722KL; SPICEPREFIX: R
S1 = switch-tact:DTSM-6; MF: DIPTRONICS; MPN: DTSM-63N-V-B
SV1 = con-harting-ml:ML10: HARTING; OC_FARNELL: unknown; OC_NEWARK: unknown
X1 = con-ptr500:AK300/2: CONNECTOR; OC_FARNELL: unknown; OC_NEWARK: unknown
X2-X4 = con-phoenix-508:MSTBA3: PHOENIX; MF: FARNELL; MPN: 1757255; OC_FARNELL: 3705183; OC_NEWARK: 71C4162

## Net classes
1 +33V: width 1.016 mm, clearance 0.61 mm

## Board
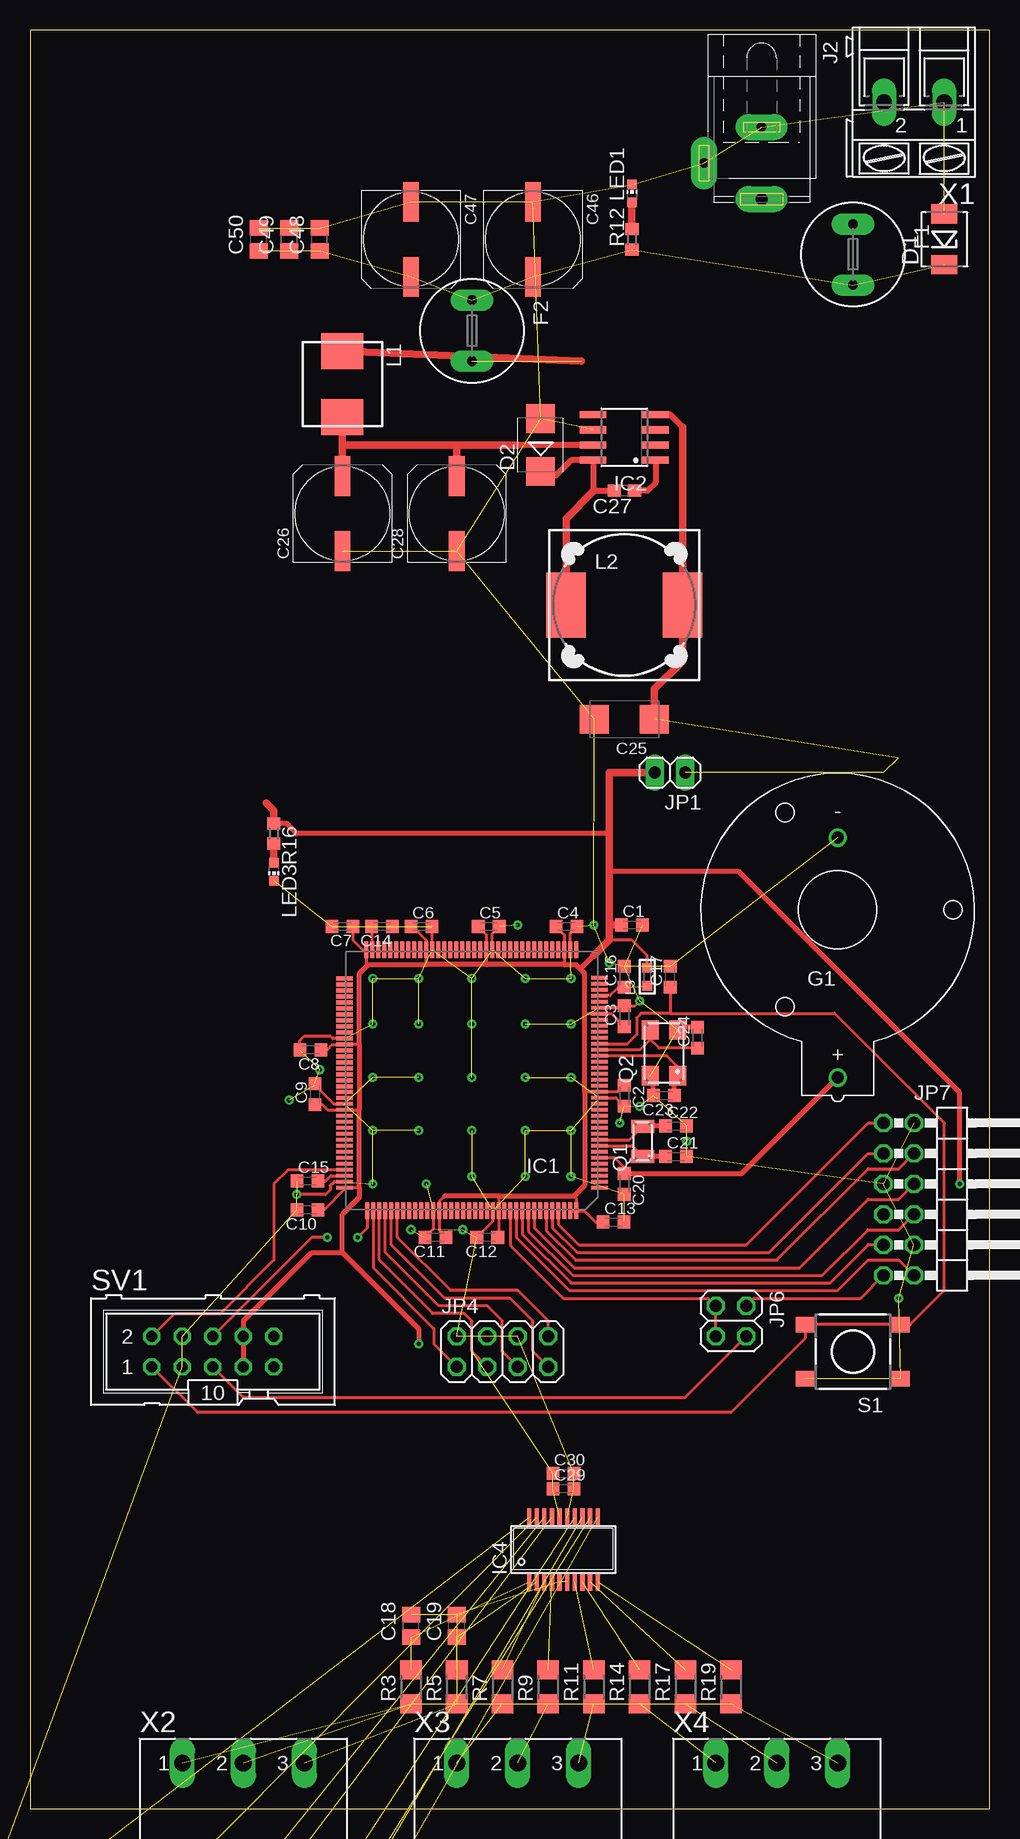
[diagram p3: board, top side]
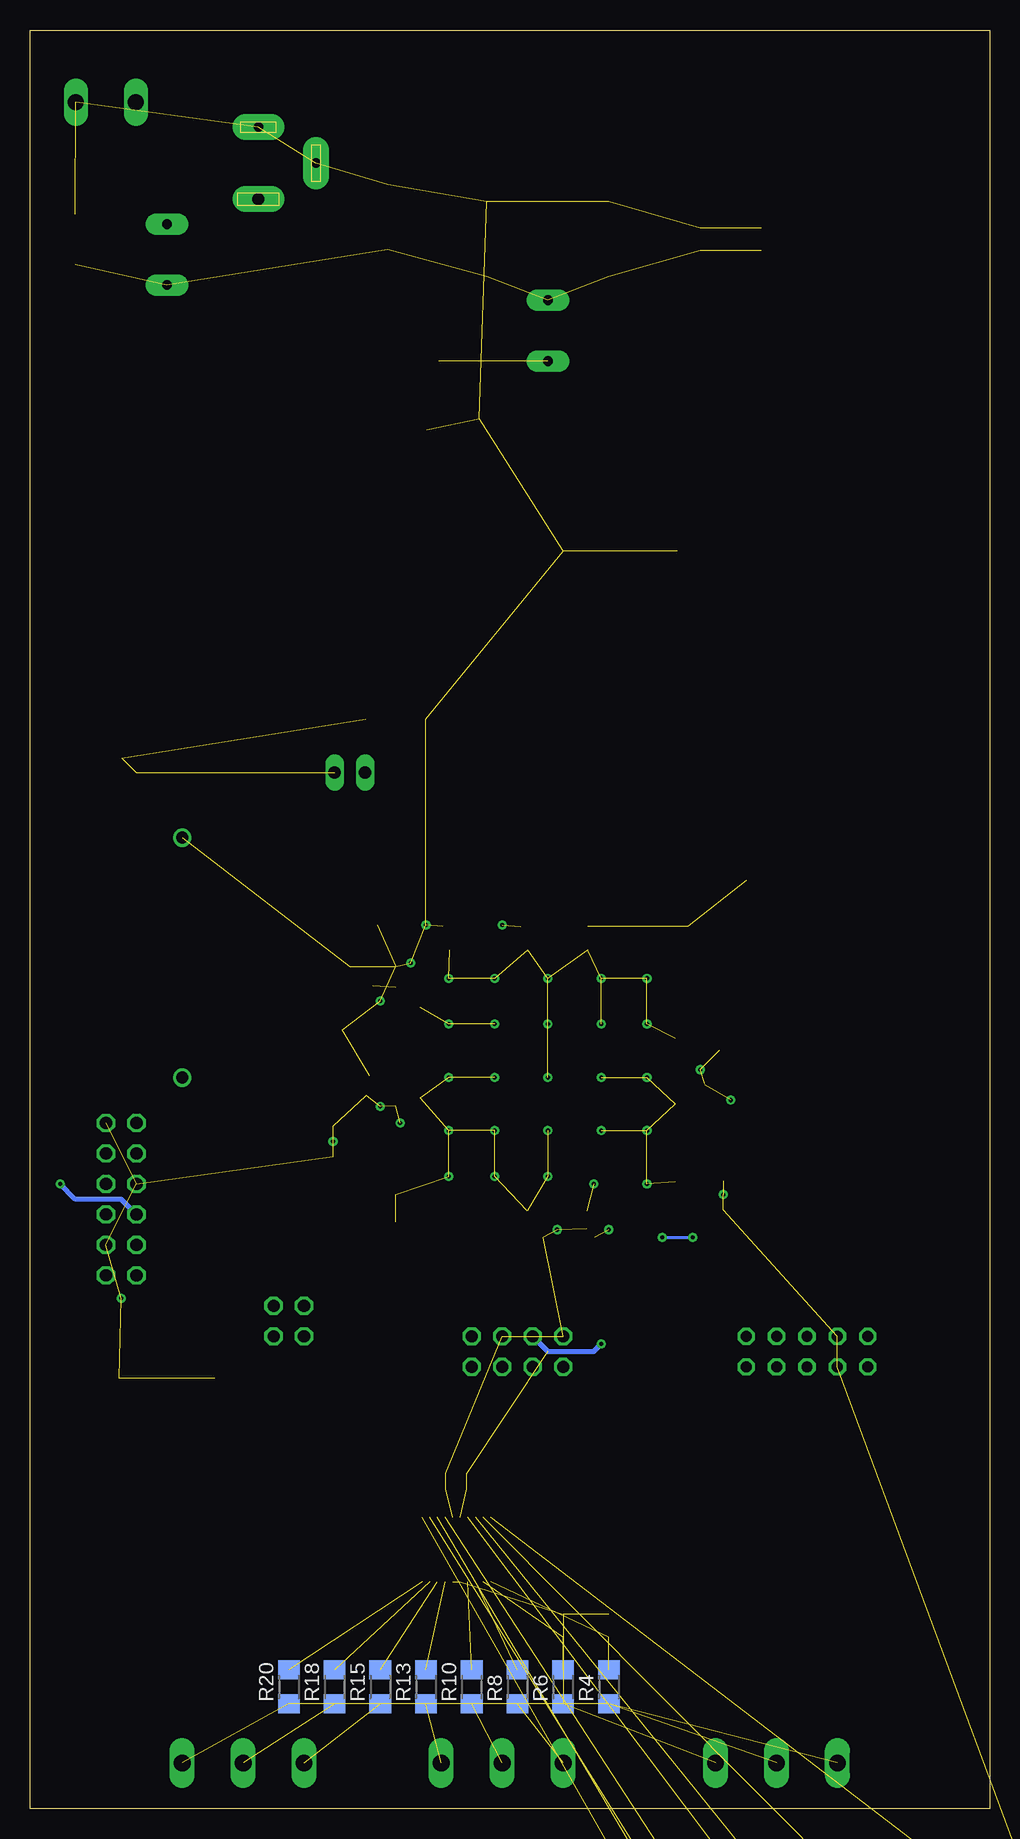
[diagram p4: board, bottom side, seen from below]

Size 79.99 x 148.26 mm. Coordinates in mm from the lower left corner, seen from the top.
Outline: 0,0 79.99,0 79.99,148.26 0,148.26 0,0
Copper layers (1*16): Top 0.035mm / dielectric 1.5mm / Bottom 0.035mm
Design rules "default *": minimum track width 6mil, minimum drill 0.35mm, track to track 6mil, track to pad 6mil, pad to pad 6mil, via to via 6mil, smd to smd 6mil, copper to edge 40mil, drill to drill 6mil, minimum pad ring 10mil, minimum via ring 8mil, stop-mask expansion 4mil, vias tented up to drill 0mil, thermal gap 10mil

### Footprints (pad centres in the part's own frame; a part is rotated, then mirrored left to right if it is on the bottom)
C0603K = smd 1.05 x 1.08: 1 -0.875,0; 2 0.875,0
C0805 = smd 1.3 x 1.5: 1 -0.95,0; 2 0.95,0
SMC_C = smd 2.4 x 2.4: + -2.5,0; - 2.5,0
UD-8X10_NICHICON = smd 3.3 x 1.3: + 3.125,0; - -3.125,0
C0603 = smd 1.1 x 1: 1 -0.85,0; 2 0.85,0
SMB_A = smd 1.62 x 2.18: A 2.11,0; C -2.11,0
SMB = smd 2.4 x 2.4: A 2.2,0; C -2.2,0
TR5 = drill 0.813 pad 1.778 long: 1 -2.54,0; 2 2.54,0
CH25-2032LF = drill 1: + 0,-14; - 0,6
LQFP144 = smd 1.35 x 0.33: 1 -10.625,9.2; 2 -10.625,8.7; 3 -10.625,8.2; 4 -10.625,7.7; 5 -10.625,7.2; 6 -10.625,6.7; 7 -10.625,6.2; 8 -10.625,5.7; 9 -10.625,5.2; 10 -10.625,4.7; 11 -10.625,4.2; 12 -10.625,3.7; 13 -10.625,3.2; 14 -10.625,2.7; 15 -10.625,2.2; 16 -10.625,1.7; 17 -10.625,1.2; 18 -10.625,0.7; 19 -10.625,0.2; 20 -10.625,-0.3; 21 -10.625,-0.8; 22 -10.625,-1.3; 23 -10.625,-1.8; 24 -10.625,-2.3; 25 -10.625,-2.8; 26 -10.625,-3.3; 27 -10.625,-3.8; 28 -10.625,-4.3; 29 -10.625,-4.8; 30 -10.625,-5.3; 31 -10.625,-5.8; 32 -10.625,-6.3; 33 -10.625,-6.8; 34 -10.625,-7.3; 35 -10.625,-7.8; 36 -10.625,-8.3; 73 10.625,-8.225; 74 10.625,-7.725; 75 10.625,-7.225; 76 10.625,-6.725; 77 10.625,-6.225; 78 10.625,-5.725; 79 10.625,-5.225; 80 10.625,-4.725; 81 10.625,-4.225; 82 10.625,-3.725; 83 10.625,-3.225; 84 10.625,-2.725; 85 10.625,-2.225; 86 10.625,-1.725; 87 10.625,-1.225; 88 10.625,-0.725; 89 10.625,-0.225; 90 10.625,0.275; 91 10.625,0.775; 92 10.625,1.225; 93 10.625,1.725; 94 10.625,2.2; 95 10.625,2.7; 96 10.625,3.2; 97 10.625,3.7; 98 10.625,4.2; 99 10.625,4.7; 100 10.625,5.2; 101 10.625,5.7; 102 10.625,6.2; 103 10.625,6.7; 104 10.625,7.2; 105 10.625,7.7; 106 10.625,8.2; 107 10.625,8.7; 108 10.625,9.2 | smd 0.33 x 1.35: 37 -8.7,-10.625; 38 -8.2,-10.625; 39 -7.7,-10.625; 40 -7.2,-10.625; 41 -6.7,-10.625; 42 -6.2,-10.625; 43 -5.7,-10.625; 44 -5.2,-10.625; 45 -4.7,-10.625; 46 -4.2,-10.625; 47 -3.7,-10.625; 48 -3.2,-10.625; 49 -2.7,-10.625; 50 -2.2,-10.625; 51 -1.7,-10.625; 52 -1.2,-10.625; 53 -0.7,-10.625; 54 -0.2,-10.625; 55 0.3,-10.625; 56 0.8,-10.625; 57 1.3,-10.625; 58 1.8,-10.625; 59 2.3,-10.625; 60 2.8,-10.625; 61 3.3,-10.625; 62 3.8,-10.625; 63 4.3,-10.625; 64 4.8,-10.625; 65 5.3,-10.625; 66 5.8,-10.625; 67 6.3,-10.625; 68 6.8,-10.625; 69 7.3,-10.625; 70 7.8,-10.625; 71 8.3,-10.625; 72 8.8,-10.625; 109 8.725,11.125; 110 8.225,11.125; 111 7.725,11.125; 112 7.225,11.125; 113 6.725,11.125; 114 6.225,11.125; 115 5.725,11.125; 116 5.225,11.125; 117 4.725,11.125; 118 4.225,11.125; 119 3.725,11.125; 120 3.225,11.125; 121 2.725,11.125; 122 2.225,11.125; 123 1.725,11.125; 124 1.225,11.125; 125 0.725,11.125; 126 0.225,11.125; 127 -0.275,11.125; 128 -0.775,11.125; 129 -1.275,11.125; 130 -1.725,11.125; 131 -2.225,11.125; 132 -2.7,11.125; 133 -3.2,11.125; 134 -3.7,11.125; 135 -4.2,11.125; 136 -4.7,11.125; 137 -5.2,11.125; 138 -5.7,11.125; 139 -6.2,11.125; 140 -6.7,11.125; 141 -7.2,11.125; 142 -7.7,11.125; 143 -8.2,11.125; 144 -8.7,11.125
SO08 = smd 0.6 x 2.2: 1 -1.905,-2.6; 2 -0.635,-2.6; 3 0.635,-2.6; 4 1.905,-2.6; 5 1.905,2.6; 6 0.635,2.6; 7 -0.635,2.6; 8 -1.905,2.6
QSOP-20 = smd 0.35 x 1.45: 1 -2.857,-2.7; 2 -2.222,-2.7; 3 -1.587,-2.7; 4 -0.952,-2.7; 5 -0.317,-2.7; 6 0.318,-2.7; 7 0.953,-2.7; 8 1.588,-2.7; 9 2.223,-2.7; 10 2.858,-2.7; 11 2.857,2.7; 12 2.222,2.7; 13 1.587,2.7; 14 0.952,2.7; 15 0.317,2.7; 16 -0.318,2.7; 17 -0.953,2.7; 18 -1.588,2.7; 19 -2.223,2.7; 20 -2.858,2.7
SPC4078 = drill 0.8 pad 2.184 long: 1 -3,0; 2 0,-4.8 | drill 1 pad 2.184 long: 3 3,0
1X02 = drill 1.016 long: 1 -1.27,0; 2 1.27,0
2X04 = drill 1.016 octagon: 1 -3.81,-1.27; 2 -3.81,1.27; 3 -1.27,-1.27; 4 -1.27,1.27; 5 1.27,-1.27; 6 1.27,1.27; 7 3.81,-1.27; 8 3.81,1.27
2X02 = drill 1.016 octagon: 1 -1.27,-1.27; 2 -1.27,1.27; 3 1.27,-1.27; 4 1.27,1.27
2X06/90 = drill 1.016 octagon: 1 -6.35,-6.35; 2 -6.35,-3.81; 3 -3.81,-6.35; 4 -3.81,-3.81; 5 -1.27,-6.35; 6 -1.27,-3.81; 7 1.27,-6.35; 8 1.27,-3.81; 9 3.81,-6.35; 10 3.81,-3.81; 11 6.35,-6.35; 12 6.35,-3.81
7.3X6.3 = smd 3 x 3.5: 1 -2.75,0; 2 2.75,0
12.5X12.5 = smd 3.3 x 5.4: 1 -4.85,0; 2 4.85,0
L0603 = smd 0.8 x 0.8: 1 -0.762,0; 2 0.762,0
CHIP-LED0603 = smd 0.8 x 0.8: A 0,-0.75; C 0,0.75
CRYSTAL_3.5X1.5 = smd 1.1 x 1.9: 1 -1.25,0; 2 1.25,0
CRYSTAL_5X3.2 = smd 1.6 x 1.4: 1 -1.9,-1.15; 2 1.91,-1.15; 3 1.91,1.15; 4 -1.9,1.15
R0603 = smd 1 x 1.1: 1 -0.85,0; 2 0.85,0
R1206 = smd 1.6 x 1.803: 1 -1.422,0; 2 1.422,0
DTSM-6 = smd 1.55 x 1.3: 1 -3.975,2.25; 2 3.975,2.25; 3 -3.975,-2.25; 4 3.975,-2.25
ML10 = drill 0.914 octagon: 1 -5.08,-1.27; 2 -5.08,1.27; 3 -2.54,-1.27; 4 -2.54,1.27; 5 0,-1.27; 6 0,1.27; 7 2.54,-1.27; 8 2.54,1.27; 9 5.08,-1.27; 10 5.08,1.27
AK300/2 = drill 1.321 long: 1 -2.515,0; 2 2.489,0
MSTBA3 = drill 1.397 long: 1 -5.08,5.08; 2 0,5.08; 3 5.08,5.08

### Placement (x,y rotation side)
C1  50.16,73.66 0 top
C2  49.53,59.44 270 top
C3  49.53,66.04 90 top
C4  44.7,73.53 0 top
C5  38.23,73.53 0 top
C6  32.64,73.53 0 top
C7  26.04,73.53 180 top
C8  23.37,63.25 180 top
C9  23.75,59.56 90 top
C10  23.11,49.91 180 top
C11  33.78,47.62 180 top
C12  38.1,47.62 180 top
C13  48.64,48.9 0 top
C14  29.34,73.53 180 top
C15  23.11,52.32 0 top
C16  49.53,69.34 90 top
C17  53.34,69.34 90 top
C18  31.75,15.24 90 top
C19  35.56,15.24 90 top
C20  49.53,52.07 270 top
C21  53.85,54.36 0 top
C22  53.85,56.9 0 top
C23  52.83,59.44 180 top
C24  55.63,64.26 90 top
C25  49.53,90.81 180 top
C26  26.04,107.95 90 top
C27  49.53,109.86 180 top
C28  35.56,107.95 90 top
C29  44.45,26.67 0 top
C30  44.45,27.94 0 top
C46  41.91,130.81 270 top
C47  31.75,130.81 270 top
C48  24.13,130.81 90 top
C49  21.59,130.81 90 top
C50  19.05,130.81 90 top
D1  76.2,130.81 90 top
D2  42.55,113.67 90 top
F1  68.58,129.54 270 top
F2  36.83,123.19 270 top
G1  67.31,74.93 0 top
IC1  36.83,60.96 180 top
IC2  49.53,114.3 90 top
IC4  44.45,21.59 0 top
J2  60.96,137.16 270 top
JP1  53.34,86.36 180 top
JP4  39.37,38.1 0 top
JP6  58.42,40.64 270 top
JP7  77.47,50.8 270 top
L1  26.04,118.75 270 top
L2  49.53,100.33 0 top
L3  51.44,69.34 90 top
LED1  50.16,134.62 0 top
LED2  -2.54,-5.08 0 top  (outside the outline)
LED3  20.32,78.11 180 top
LED4  -2.54,-17.78 0 top  (outside the outline)
LED5  -2.54,-29.21 0 top  (outside the outline)
LED6  1.27,-29.21 0 top  (outside the outline)
LED7  1.27,-45.72 0 top  (outside the outline)
LED8  5.08,-45.72 0 top  (outside the outline)
LED9  8.89,-45.72 0 top  (outside the outline)
LED10  -2.54,-46.99 0 top  (outside the outline)
Q1  51.05,55.63 90 top
Q2  52.83,62.99 90 top
R1  -2.54,-10.16 0 top  (outside the outline)
R2  -2.54,-21.59 0 top  (outside the outline)
R3  31.75,10.16 90 top
R4  31.75,10.16 90 bottom
R5  35.56,10.16 90 top
R6  35.56,10.16 90 bottom
R7  39.37,10.16 90 top
R8  39.37,10.16 90 bottom
R9  43.18,10.16 90 top
R10  43.18,10.16 90 bottom
R11  46.99,10.16 90 top
R12  50.16,130.81 90 top
R13  46.99,10.16 90 bottom
R14  50.8,10.16 90 top
R15  50.8,10.16 90 bottom
R16  20.32,81.28 270 top
R17  54.61,10.16 90 top
R18  54.61,10.16 90 bottom
R19  58.42,10.16 90 top
R20  58.42,10.16 90 bottom
R21  -2.54,-33.02 0 top  (outside the outline)
R22  -2.54,-38.1 0 top  (outside the outline)
R23  -2.54,-50.8 0 top  (outside the outline)
R24  2.54,-50.8 0 top  (outside the outline)
R25  -2.54,-55.88 0 top  (outside the outline)
R26  2.54,-55.88 0 top  (outside the outline)
S1  68.58,38.1 180 top
SV1  15.24,38.1 0 top
X1  73.66,142.24 180 top
X2  17.78,-1.27 0 top
X3  40.64,-1.27 0 top
X4  62.23,-1.27 0 top

### Tracks (layer width: path | path; a pad name or v marks a point on that pad's centre or on a via)
+3V3  (via drill 0.35)  (3 unrouted)
  Top 0.254: C5.1 38.03,72.86 IC1.52 38.03,70.43 38.1,70.36 | C2.1 48.98,59.76 IC1.17 46.23,59.76 | C4.1 44.53,72.83 IC1.39 44.53,70.36 | C9.1 24.37,58.69 24.8,58.26 IC1.95 27.43,58.26 | C7.1 26.91,72.4 27.73,71.58 IC1.72 28.03,70.52 28.19,70.36 | 34.54,51.05 34.1,50.62 IC1.121 34.1,48.18 C11.1 | IC1.144 45.53,50.86 45.34,51.05 | IC1.143 IC1.144 | 33.02,70.36 33.03,70.37 IC1.62 33.03,72.38 31.88,73.53 C6.1 | 46.23,66.26 IC1.30 48.44,66.26 C3.1 | 39.05,51.05 IC1.131 39.05,47.7 C12.1 | 27.43,63.69 IC1.84 25.2,63.69 24.77,63.25 C8.1 | 27.43,51.76 IC1.108 26.2,51.6 24.51,49.91 C10.1 | L3.2 51.44,71.12 50.16,72.39 48.26,72.39 | C13.1 47.12,48.9 46.18,49.84 IC1.144
  Top 0.406: 45.85,69.98 45.47,70.36 44.53,70.36 38.1,70.36 33.02,70.36 28.19,70.36 27.43,69.6 27.43,63.69 27.43,58.26 27.43,51.76 27.43,50.93 26.04,49.53 26.04,46.35 | 45.85,69.98 46.23,69.6 46.23,66.26 46.23,59.76 46.23,51.94 45.34,51.05 39.05,51.05 34.54,51.05 | v32.38,38.73 32.38,40.01 26.04,46.35 | 26.04,46.35 23.5,46.35 17.78,40.64 SV1.8 SV1.7 | 46.99,71.12 45.85,69.98 | v77.47,52.07 77.47,59.69 59.05,78.11 48.26,78.11 | R16.1 21.38,82.13 22.23,81.28 48.26,81.28
  Top 0.61: JP1.2 48.26,86.36 48.26,81.28 48.26,78.11 48.26,73.66 | 48.26,73.66 48.26,72.39 46.99,71.12 | C1.1 48.26,73.66 | R16.1 20.32,83.19 19.68,83.82
  Bottom 0.406: JP4.4 36.83,38.1 33.02,38.1 v32.38,38.73 | JP7.7 72.39,50.8 76.2,50.8 v77.47,52.07
+12V  (8 unrouted)
COM  (12 unrouted)
D0  (1 unrouted)
D1  (1 unrouted)
D2  (1 unrouted)
D3  (1 unrouted)
D4  (1 unrouted)
D5  (1 unrouted)
D6  (1 unrouted)
D7  (1 unrouted)
ETH_CS
  Top 0.254: IC1.114 30.61,47.62 35.05,43.18 40.64,43.18 43.18,40.64 JP4.8
ETH_INT
  Top 0.254: IC1.110 28.61,45.05 33.66,40.01 33.66,38.73 JP4.1
GND  (via drill 0.35)  (95 unrouted)
  Top 0.254: IC1.51 38.53,72.96 C5.2 | IC1.16 48.83,59.26 C2.2 | IC1.38 45.03,72.98 C4.2 | IC1.130 38.55,48.95 C12.2 | IC1.94 25.31,58.76 23.75,60.33 C9.2 | IC1.61 33.53,73.42 C6.2 | IC1.120 33.6,48.32 C11.2 | IC1.31 49.38,66.76 C3.2 50.41,66.92 v50.8,67.31 | IC1.107 25.34,52.26 25.02,51.94 25.02,51.56 24.64,51.18 v22.23,51.18 | IC1.83 25.22,64.19 25.02,64.39 22.86,64.39 22.49,64.02 C8.2
  Top 0.406: C24.2 54.22,65.14 Q2.2 | C23.2 51.96,60.82 Q2.4
  other vias: 21.59,59.05 24.13,61.59 28.57,69.22 45.09,69.22 41.27,69.22 32.38,69.22 36.83,69.22 28.57,65.41 45.09,65.41 41.27,65.41 32.38,65.41 36.83,65.41 28.57,60.96 45.09,60.96 41.27,60.96 32.38,60.96 36.83,60.96 28.57,56.52 45.09,56.52 41.27,56.52 32.38,56.52 36.83,56.52 28.57,52.07 45.09,52.7 41.27,52.7 33.02,52.07 36.83,52.7 49.15,57.15 50.8,58.55 54.74,55.63 48.26,70.48 40.64,73.66 46.99,73.66 31.75,48.26 36.07,48.26 72.39,42.55
GPIO_0
  Top 0.254: IC1.136 41.53,48.13 45.21,44.45 66.04,44.45 69.85,48.26 72.39,48.26 JP7.8
GPIO_1
  Top 0.254: IC1.137 42.03,48.39 45.34,45.09 64.14,45.09 69.85,50.8 72.39,50.8 JP7.6
GPIO_2
  Top 0.254: IC1.139 43.03,48.16 45.47,45.72 62.23,45.72 69.85,53.34 72.39,53.34 JP7.4
GPIO_3
  Top 0.254: IC1.140 43.53,48.42 45.59,46.35 61.59,46.35 69.85,54.61 JP7.3
GPIO_4
  Top 0.254: IC1.141 44.03,48.68 45.72,46.99 59.69,46.99 69.85,57.15 JP7.1
N$2
  Top 0.254: IC1.71 28.53,73.47 C14.2
N$3
  Top 0.254: IC1.106 25.07,52.76 24.64,52.32 C15.2
N$4
  Top 0.254: IC1.8 50.17,55.26 Q1.1
  Top 0.406: C21.1 51.07,54.36 Q1.1
N$5
  Top 0.254: IC1.9 49.94,55.76 Q1.2
  Top 0.406: C22.1 51.07,56.9 Q1.2
N$6
  Top 0.254: IC1.133 40.03,46.97 44.45,42.55 56.52,42.55 JP6.1 JP6.3
N$7
  Top 0.254: IC1.23 53.06,62.76 53.98,61.84 Q2.1
  Top 0.406: C23.1 53.71,60.82 Q2.1
N$8
  Top 0.254: IC1.24 50.81,63.26 51.68,64.13 | 51.68,64.13 Q2.3 | C24.1 52.42,63.39 51.68,64.13
N$9  (3 unrouted)
N$10  (1 unrouted)
  Top 0.61: 45.93,120.65 L1.1
N$11  (1 unrouted)
N$12  (3 unrouted)
N$13  (1 unrouted)
N$14  (1 unrouted)
N$15  (1 unrouted)
N$16
  Top 0.508: IC2.1 52.13,110.55 51.44,109.86 C27.1
N$17  (1 unrouted)
N$18  (1 unrouted)
N$19  (2 unrouted)
N$20  (1 unrouted)
N$21  (2 unrouted)
N$22  (1 unrouted)
N$23  (2 unrouted)
N$24  (1 unrouted)
N$25  (2 unrouted)
N$26  (1 unrouted)
N$27  (2 unrouted)
N$28  (1 unrouted)
N$29  (2 unrouted)
N$30  (1 unrouted)
N$31
  Top 0.61: R12.2 LED1.A
N$32  (1 unrouted)
N$33  (1 unrouted)
N$34  (1 unrouted)
N$35  (1 unrouted)
N$37  (3 unrouted)
  Top 0.508: IC2.4 53.34,116.2 54.38,115.17
  Top 0.61: 54.38,115.17 L2.2 54.38,95.66 52.03,93.31 C25.+
N$42
  Top 0.61: R16.2 LED3.A
NRST
  Top 0.254: IC1.25 49.79,63.76 50.55,64.52 50.55,65.91 50.93,66.29 53.34,66.29 | C17.1 53.34,66.29 | 53.34,66.29 67.06,66.29 76.2,57.15 76.2,43.18 73.37,40.35 S1.3 S1.4 64.61,39.2 58.42,33.02 13.97,33.02 SV1.1
SPI1_MISO
  Top 0.254: IC1.134 40.53,47.61 44.96,43.18 67.31,43.18 69.85,45.72 72.39,45.72 JP7.12
SPI1_MOSI
  Top 0.254: IC1.135 41.03,47.87 45.09,43.81 66.67,43.81 69.85,46.99 JP7.9
SPI1_SCK
  Top 0.254: JP6.2 60.33,42.55 69.22,42.55 JP7.11
SPI3_MISO
  Top 0.254: IC1.112 29.61,46.35 34.05,41.91 38.1,41.91 39.37,40.64 39.37,38.1 JP4.5
SPI3_MOSI
  Top 0.254: IC1.113 30.11,46.99 34.55,42.55 40.01,42.55 41.91,40.64 41.91,38.1 JP4.7
SPI3_SCK
  Top 0.254: IC1.111 29.11,45.72 33.55,41.27 36.2,41.27 36.83,40.64 36.83,38.1 JP4.3
SWCLK  (via drill 0.35)
  Top 0.254: IC1.109 28.11,48.42 v27.3,47.62 | v24.77,47.62 23.5,47.62 SV1.6
  Bottom 0.254: v27.3,47.62 v24.77,47.62
SWDIO
  Top 0.254: IC1.105 21.51,53.26 20.32,52.07 20.32,45.72 15.88,41.27 12.06,41.27 SV1.2
SWO
  Top 0.254: SV1.5 17.78,34.29 54.61,34.29 JP6.4
VBAT
  Top 0.254: IC1.6 48.74,54.26 49.53,53.47 C20.1
  Top 0.406: G1.+ 59.33,52.95 C20.1
VDD  (1 unrouted)
  Top 0.254: C16.1 49.04,68.47 48.33,67.76 IC1.33
VIN
  Top 0.508: IC2.7 40.64,113.67
  Top 0.61: 35.56,113.67 26.04,113.67 | 35.56,113.67 40.64,113.67 | C26.+ 26.04,113.67 | L1.2 26.04,113.67 | C28.+ 35.56,113.67
VSW
  Top 0.508: C27.2 46.99,109.86 46.99,112.33 IC2.8 45.09,112.39 43.81,111.12 42.88,111.12 D2.C
  Top 0.61: L2.1 44.68,107.55 46.99,109.86